# Altium project 1166V10.PrjPCB (part 2 of 2)

## Sheet 1166V10-5.SchDoc: HV-Input & Measurement-Driver
size A3; Author: M. Kutzsche; Organization: Kübrich Ing.-Gesellschaft; Address1: mbH & Co. KG; Address2: Weißmühle 10; Address3: D-96170 Priesendorf; DocumentNumber: UltraZohm; Revision: 10; SheetNumber: 5; SheetTotal: 5
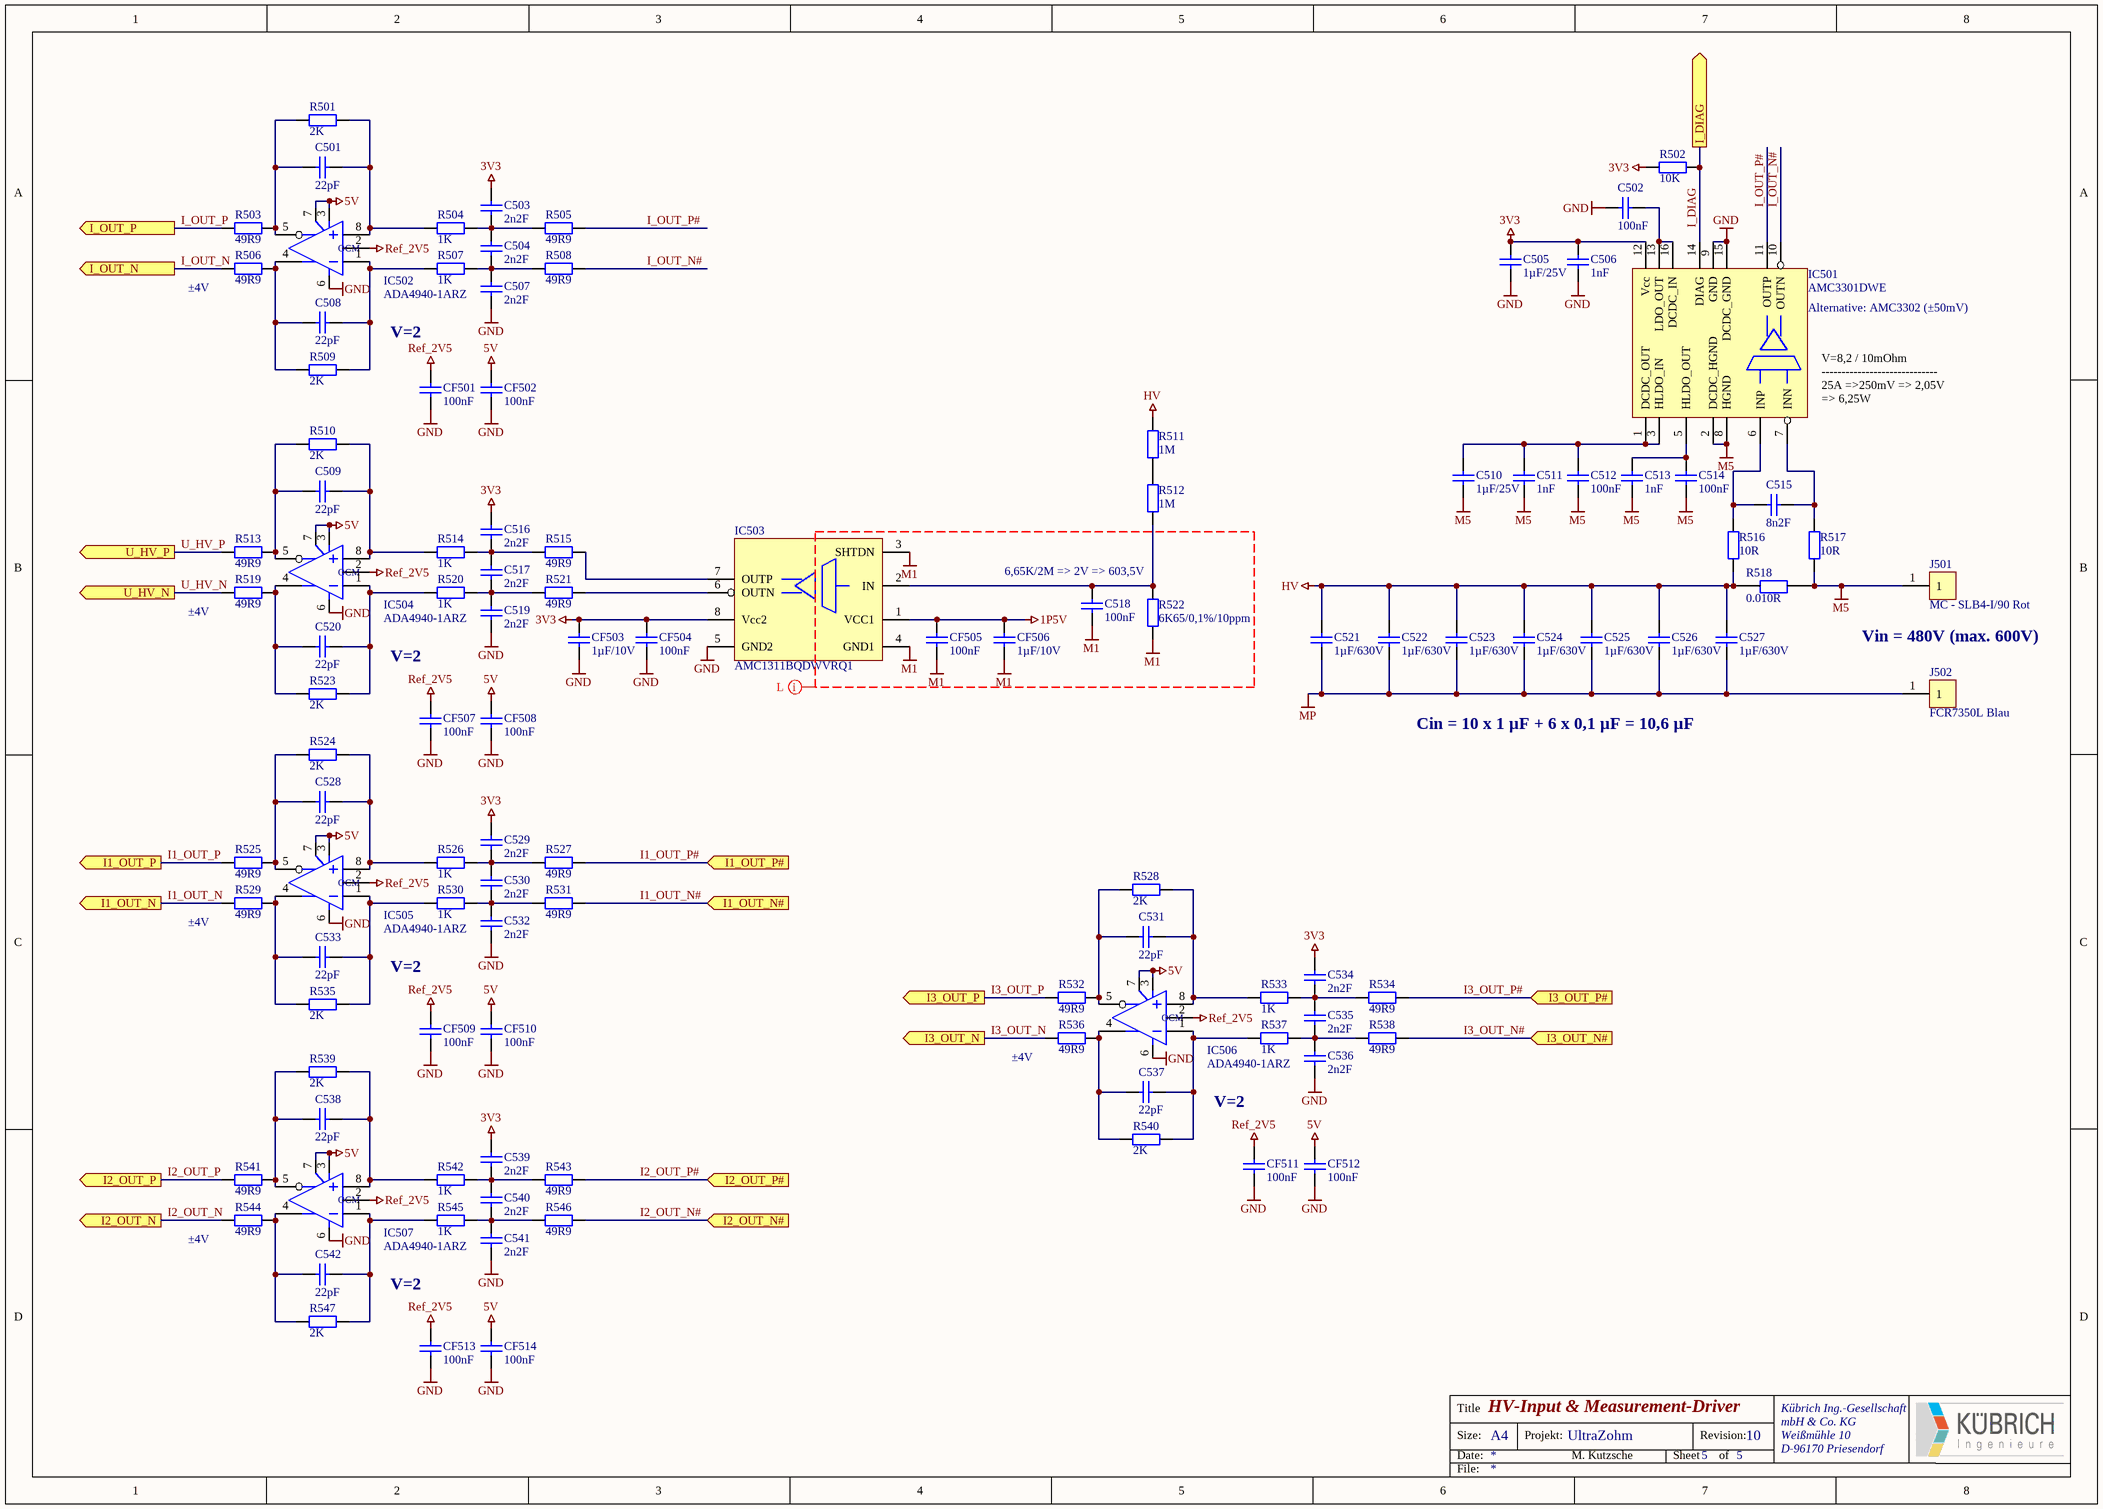
[diagram p4: 1166V10-5.SchDoc]

### Parts
C501  22pF  [0603-Cap]
C502  100nF  [0603-Cap]
C503  2n2F  [0603-Cap]
C504  2n2F  [0603-Cap]
C505  1µF/25V  [1206-Cap]
C506  1nF  [1206-Cap]
C507  2n2F  [0603-Cap]
C508  22pF  [0603-Cap]
C509  22pF  [0603-Cap]
C510  1µF/25V  [0603-Cap]
C511  1nF  [0603-Cap]
C512  100nF  [0603-Cap]
C513  1nF  [1206-Cap]
C514  100nF  [1206-Cap]
C515  8n2F  [0603-Cap]
C516  2n2F  [0603-Cap]
C517  2n2F  [0603-Cap]
C518  100nF  [0603-Cap]
C519  2n2F  [0603-Cap]
C520  22pF  [0603-Cap]
C521  1µF/630V  [2220-Cap]
C522  1µF/630V  [2220-Cap]
C523  1µF/630V  [2220-Cap]
C524  1µF/630V  [2220-Cap]
C525  1µF/630V  [2220-Cap]
C526  1µF/630V  [2220-Cap]
C527  1µF/630V  [2220-Cap]
C528  22pF  [0603-Cap]
C529  2n2F  [0603-Cap]
C530  2n2F  [0603-Cap]
C531  22pF  [0603-Cap]
C532  2n2F  [0603-Cap]
C533  22pF  [0603-Cap]
C534  2n2F  [0603-Cap]
C535  2n2F  [0603-Cap]
C536  2n2F  [0603-Cap]
C537  22pF  [0603-Cap]
C538  22pF  [0603-Cap]
C539  2n2F  [0603-Cap]
C540  2n2F  [0603-Cap]
C541  2n2F  [0603-Cap]
C542  22pF  [0603-Cap]
CF501  100nF  [0603-Cap]
CF502  100nF  [0603-Cap]
CF503  1µF/10V  [0603-Cap]
CF504  100nF  [0603-Cap]
CF505  100nF  [0603-Cap]
CF506  1µF/10V  [0603-Cap]
CF507  100nF  [0603-Cap]
CF508  100nF  [0603-Cap]
CF509  100nF  [0603-Cap]
CF510  100nF  [0603-Cap]
CF511  100nF  [0603-Cap]
CF512  100nF  [0603-Cap]
CF513  100nF  [0603-Cap]
CF514  100nF  [0603-Cap]
IC501  AMC3301DWE  [SOIC-16-W - 8.1mm]
IC502  ADA4940-1ARZ  [SOIC-8-N]
IC503  AMC1311BQDWVRQ1  [SOIC-8-W]
IC504  ADA4940-1ARZ  [SOIC-8-N]
IC505  ADA4940-1ARZ  [SOIC-8-N]
IC506  ADA4940-1ARZ  [SOIC-8-N]
IC507  ADA4940-1ARZ  [SOIC-8-N]
J501  MC - SLB4-I/90 Rot  [SLB4-I/90 - 4mm]
J502  FCR7350L Blau  [SLB4-I/90 - 4mm - CLIFF]
R501  2K  [0603-Res]
R502  10K  [0603-Res]
R503  49R9  [0603-Res]
R504  1K  [0603-Res]
R505  49R9  [0603-Res]
R506  49R9  [0603-Res]
R507  1K  [0603-Res]
R508  49R9  [0603-Res]
R509  2K  [0603-Res]
R510  2K  [0603-Res]
R511  1M  [2512-Res]
R512  1M  [2512-Res]
R513  49R9  [0603-Res]
R514  1K  [0603-Res]
R515  49R9  [0603-Res]
R516  10R  [0603-Res]
R517  10R  [0603-Res]
R518  0.010R  [2512]
R519  49R9  [0603-Res]
R520  1K  [0603-Res]
R521  49R9  [0603-Res]
R522  6K65/0,1%/10ppm  [0603-Res]
R523  2K  [0603-Res]
R524  2K  [0603-Res]
R525  49R9  [0603-Res]
R526  1K  [0603-Res]
R527  49R9  [0603-Res]
R528  2K  [0603-Res]
R529  49R9  [0603-Res]
R530  1K  [0603-Res]
R531  49R9  [0603-Res]
R532  49R9  [0603-Res]
R533  1K  [0603-Res]
R534  49R9  [0603-Res]
R535  2K  [0603-Res]
R536  49R9  [0603-Res]
R537  1K  [0603-Res]
R538  49R9  [0603-Res]
R539  2K  [0603-Res]
R540  2K  [0603-Res]
R541  49R9  [0603-Res]
R542  1K  [0603-Res]
R543  49R9  [0603-Res]
R544  49R9  [0603-Res]
R545  1K  [0603-Res]
R546  49R9  [0603-Res]
R547  2K  [0603-Res]

### Ports
I1_OUT_N (out), I1_OUT_N# (in), I1_OUT_P (out), I1_OUT_P# (in), I2_OUT_N (out), I2_OUT_N# (in), I2_OUT_P (out), I2_OUT_P# (in), I3_OUT_N (out), I3_OUT_N# (in), I3_OUT_P (out), I3_OUT_P# (in), I_DIAG (out), I_OUT_N (out), I_OUT_P (out), U_HV_N (out), U_HV_P (out)

### Nets
1P5V: CF505.1 CF506.1 IC503.1(VCC1)
3V3: C503.2 C505.1 C506.1 C516.2 C529.2 C534.2 C539.2 CF503.1 CF504.1 IC501.12(Vcc) IC503.8(Vcc2) R502.2
5V: CF502.1 CF508.1 CF510.1 CF512.1 CF514.1 IC502.3(V+) IC502.7(EN) IC504.3(V+) IC504.7(EN) IC505.3(V+) IC505.7(EN) IC506.3(V+) IC506.7(EN) IC507.3(V+) IC507.7(EN)
GND: C502.1 C505.2 C506.2 C507.1 C519.1 C532.1 C536.1 C541.1 CF501.2 CF502.2 CF503.2 CF504.2 CF507.2 CF508.2 CF509.2 CF510.2 CF511.2 CF512.2 CF513.2 CF514.2 IC501.9(GND) IC501.15(DCDC_GND) IC502.6(V-) IC503.5(GND2) IC504.6(V-) IC505.6(V-) IC506.6(V-) IC507.6(V-)
HV: C521.1 C522.1 C523.1 C524.1 C525.1 C526.1 C527.1 R511.2 R516.1 R518.1
M1: C518.1 CF505.2 CF506.2 IC503.3(SHTDN) IC503.4(GND1) R522.2
M5: C510.2 C511.2 C512.2 C513.2 C514.2 IC501.2(DCDC_HGND) IC501.8(HGND) J501.1 R517.1 R518.2
MP: C521.2 C522.2 C523.2 C524.2 C525.2 C526.2 C527.2 J502.1
Ref_2V5: CF501.1 CF507.1 CF509.1 CF511.1 CF513.1 IC502.2(OCM) IC504.2(OCM) IC505.2(OCM) IC506.2(OCM) IC507.2(OCM)
I1_OUT_N: R529.2 ; port I1_OUT_N
I1_OUT_N#: R531.1 ; port I1_OUT_N#
I1_OUT_P: R525.2 ; port I1_OUT_P
I1_OUT_P#: R527.1 ; port I1_OUT_P#
I2_OUT_N: R544.2 ; port I2_OUT_N
I2_OUT_N#: R546.1 ; port I2_OUT_N#
I2_OUT_P: R541.2 ; port I2_OUT_P
I2_OUT_P#: R543.1 ; port I2_OUT_P#
I3_OUT_N: R536.2 ; port I3_OUT_N
I3_OUT_N#: R538.1 ; port I3_OUT_N#
I3_OUT_P: R532.2 ; port I3_OUT_P
I3_OUT_P#: R534.1 ; port I3_OUT_P#
I_DIAG: IC501.14(DIAG) R502.1 ; port I_DIAG
I_OUT_N: R506.2 ; port I_OUT_N
I_OUT_N#: IC501.10(OUTN) R508.1
I_OUT_P: R503.2 ; port I_OUT_P
I_OUT_P#: IC501.11(OUTP) R505.1
U_HV_N: R519.2 ; port U_HV_N
U_HV_P: R513.2 ; port U_HV_P
NetC501_1: C501.1 IC502.8(+) R501.1 R504.2
NetC501_2: C501.2 IC502.5(Out) R501.2 R503.1
NetC502_2: C502.2 IC501.13(LDO_OUT) IC501.16(DCDC_IN)
NetC503_1: C503.1 C504.2 R504.1 R505.2
NetC504_1: C504.1 C507.2 R507.1 R508.2
NetC508_1: C508.1 IC502.1(-) R507.2 R509.1
NetC508_2: C508.2 IC502.4(Out) R506.1 R509.2
NetC509_1: C509.1 IC504.8(+) R510.1 R514.2
NetC509_2: C509.2 IC504.5(Out) R510.2 R513.1
NetC510_1: C510.1 C511.1 C512.1 IC501.1(DCDC_OUT) IC501.3(HLDO_IN)
NetC513_1: C513.1 C514.1 IC501.5(HLDO_OUT)
NetC515_1: C515.1 IC501.7(INN) R517.2
NetC515_2: C515.2 IC501.6(INP) R516.2
NetC516_1: C516.1 C517.2 R514.1 R515.2
NetC517_1: C517.1 C519.2 R520.1 R521.2
NetC518_2: C518.2 IC503.2(IN) R512.1 R522.1
NetC520_1: C520.1 IC504.1(-) R520.2 R523.1
NetC520_2: C520.2 IC504.4(Out) R519.1 R523.2
NetC528_1: C528.1 IC505.8(+) R524.1 R526.2
NetC528_2: C528.2 IC505.5(Out) R524.2 R525.1
NetC529_1: C529.1 C530.2 R526.1 R527.2
NetC530_1: C530.1 C532.2 R530.1 R531.2
NetC531_1: C531.1 IC506.8(+) R528.1 R533.2
NetC531_2: C531.2 IC506.5(Out) R528.2 R532.1
NetC533_1: C533.1 IC505.1(-) R530.2 R535.1
NetC533_2: C533.2 IC505.4(Out) R529.1 R535.2
NetC534_1: C534.1 C535.2 R533.1 R534.2
NetC535_1: C535.1 C536.2 R537.1 R538.2
NetC537_1: C537.1 IC506.1(-) R537.2 R540.1
NetC537_2: C537.2 IC506.4(Out) R536.1 R540.2
NetC538_1: C538.1 IC507.8(+) R539.1 R542.2
NetC538_2: C538.2 IC507.5(Out) R539.2 R541.1
NetC539_1: C539.1 C540.2 R542.1 R543.2
NetC540_1: C540.1 C541.2 R545.1 R546.2
NetC542_1: C542.1 IC507.1(-) R545.2 R547.1
NetC542_2: C542.2 IC507.4(Out) R544.1 R547.2
NetIC503_6: IC503.6(OUTN) R521.1
NetIC503_7: IC503.7(OUTP) R515.1
NetR511_1: R511.1 R512.2

### Layout directives
net class L: 1P5V, M1

### Notes on the sheet
- (near R506) ±4V
- (near IC501) Alternative: AMC3302 (±50mV)
- V=2
- (near IC501) V=8,2 / 10mOhm
  -----------------------------
  25A =>250mV => 2,05V
  => 6,25W
- 6,65K/2M => 2V => 603,5V
- (near R519) ±4V
- Vin = 480V (max. 600V)
- Cin = 10 x 1 µF + 6 x 0,1 µF = 10,6 µF
- (near R529) ±4V
- (near R536) ±4V
- (near R544) ±4V
- Title
- Size:
- Date:
- A4
- Projekt:
- Sheet
- Revision:
- of
- File:

### Library data of the parts
C501-C542 CF501-CF514 = Cap_SMD: Capacitor (SMD); Class I: Pasiv; Class II: Capacitor; Last edited: 20.11.2006 10:25
  C501 C508 C509 C520 C528 C531 C533 C537 C538 C542: value: 22pF
  C502 C512 C514 C518 CF501 CF502 CF504 CF505 CF507-CF514: value: 100nF
  C503 C504 C507 C516 C517 C519 C529 C530 C532 C534-C536 C539-C541: value: 2n2F
  C505 C510: value: 1µF/25V
  C506 C511 C513: value: 1nF
  C515: value: 8n2F
  C521-C527: value: 1µF/630V
  CF503 CF506: value: 1µF/10V
IC501 = AMC3301DWE: ±250 mV Input Voltage Range, Reinforced Isolated Amplifier and High Bandwidth of 300 kHz; Manufacturer: Texas Instruments; Class II: ±250 mV, 300KHz, -40-125°C; Package information: Unknown; Best.-Nr.: DigiKey: 296-AMC3301DWE-ND; Class I: Isolated Amplifier; Datasheet: Unknown; Package reference: SOIC-16-W
IC502 IC504-IC507 = ADA4940-1ARZ: Fully Differential ADC Drivers (-40-125°C); Manufacturer: ANALOG DEVICES; Class I: Analog; Best.-Nr.: Farnell 209-6178; Class II: Fully Differential ADC Drivers (-40-125°C); Datasheet: DSO11449, Ver. Aug 2000; Last edited: 04.01.2007 10:14; Package Reference: SOIC-N-8
IC503 = AMC1311BQDWVRQ1: 2V Input, Automotive High-Impedance, Reinforced Isolated Amplifier for Voltage Sensing; Manufacturer: Texas Instruments; Class II: 2V, 275KHz, -40-125°C; Package information: Unknown; Best.-Nr.: Mouser: 595-AMC1311BQDWVRQ1; Class I: Isolated Amplifier; Datasheet: Unknown; Package reference: SOIC-8-W
J501 = MC - SLB4-I/90 Rot: Labor Winkelbuchsen 4mm Rot; Manufacturer: Multi-Contact; Class I: Connectors; Best.-Nr.: Farnell: 413-0261; Class II: Labor Winkelbuchsen 4mm Rot; Last edited: 07.03.2007 13:28
J502 = FCR7350L Blau: Labor Winkelbuchsen 4mm Blau; Manufacturer: CLIFF Electronic; Class I: Connectors; Best.-Nr.: Farnell: 185-4511; Class II: Labor Winkelbuchsen 4mm Blau; Last edited: 07.03.2007 13:28
R501-R510 R513-R517 R519-R547 = Res_SMD: Resistor SMD; Class I: Pasiv; Class II: Resistor; Last edited: 17.11.2006 11:38
  R501 R509 R510 R523 R524 R528 R535 R539 R540 R547: value: 2K
  R502: value: 10K
  R503 R505 R506 R508 R513 R515 R519 R521 R525 R527 R529 R531 R532 R534 R536 R538 R541 R543 R544 R546: value: 49R9
  R504 R507 R514 R520 R526 R530 R533 R537 R542 R545: value: 1K
  R516 R517: value: 10R
  R522: value: 6K65/0,1%/10ppm
R511 R512 = HVCB2512BDE1M00: Resistor SMD 1M/0,1%/3KV/2W/25ppm/°C; Class I: Pasiv; Best.-Nr.: DigiKey: HVCB2512BDE1M00CT-ND; Class II: Resistor; Last edited: 17.11.2006 11:38; value: 1M
R518 = LRMAP2512-R01FT4: 10mOhm, 3W, 1%, 50ppm/°C; Manufacturer: TT Electronics; Class I: Pasiv; Class II: Shunt 3W; Best.-Nr.: Farnell: 207-9429; Last edited: 23.11.2010 14:12; value: 0.010R

## Nets that join several sheets
1P5V: 1166V10-2 (10 pins), 1166V10-3 (6 pins), 1166V10-4 (6 pins), 1166V10-5 (CF505.1 CF506.1 IC503.1)
1P12V: 1166V10-2 (8 pins), 1166V10-3 (C322.2 Q302.46), 1166V10-4 (C422.2 Q402.46)
3V3: 1166V10-1 (29 pins), 1166V10-2 (18 pins), 1166V10-3 (18 pins), 1166V10-4 (18 pins), 1166V10-5 (12 pins)
5V: 1166V10-1 (C106.2 C107.2 L102.2), 1166V10-2 (CF211.1 IC206.3 IC206.7), 1166V10-3 (CF308.1 IC305.3 IC305.7), 1166V10-4 (CF408.1 IC405.3 IC405.7), 1166V10-5 (15 pins)
GND: 1166V10-1 (89 pins), 1166V10-2 (26 pins), 1166V10-3 (23 pins), 1166V10-4 (23 pins), 1166V10-5 (28 pins)
HV: 1166V10-2 (21 pins), 1166V10-3 (21 pins), 1166V10-4 (21 pins), 1166V10-5 (10 pins)
M1: 1166V10-2 (27 pins), 1166V10-3 (18 pins), 1166V10-4 (18 pins), 1166V10-5 (6 pins)
MP: 1166V10-1 (JX101.1 JX102.1 JX103.1 JX104.1), 1166V10-2 (31 pins), 1166V10-3 (31 pins), 1166V10-4 (31 pins), 1166V10-5 (8 pins)
P24V: 1166V10-1 (D101.2 J101.2 J102.5 J102.6), 1166V10-2 (C206.2 C222.2 L201.1 L204.1), 1166V10-3 (C306.2 L301.1), 1166V10-4 (C406.2 L401.1)
Ref_2V5: 1166V10-1 (5 pins), 1166V10-2 (CF210.1 IC206.2), 1166V10-3 (CF307.1 IC305.2), 1166V10-4 (CF407.1 IC405.2), 1166V10-5 (10 pins)
GaN_H1_FAULT: 1166V10-1 (IC101.12 J102.50), 1166V10-2 (IC202.12 R201.2)
GaN_H1_OC: 1166V10-1 (IC101.10 J102.46), 1166V10-2 (IC202.13 R202.2)
GaN_H1_Temp: 1166V10-1 (J102.30), 1166V10-2 (IC202.14)
GaN_H2_FAULT: 1166V10-1 (IC105.12 J102.74), 1166V10-3 (IC302.12 R301.2)
GaN_H2_OC: 1166V10-1 (IC105.10 J102.70), 1166V10-3 (IC302.13 R302.2)
GaN_H2_Temp: 1166V10-1 (J102.54), 1166V10-3 (IC302.14)
GaN_H3_FAULT: 1166V10-1 (IC109.12 J102.73), 1166V10-4 (IC402.12 R401.2)
GaN_H3_OC: 1166V10-1 (IC109.10 J102.69), 1166V10-4 (IC402.13 R402.2)
GaN_H3_Temp: 1166V10-1 (J102.53), 1166V10-4 (IC402.14)
GaN_L1_FAULT: 1166V10-1 (IC101.4 J102.42), 1166V10-2 (IC204.14 R204.2)
GaN_L1_OC: 1166V10-1 (IC101.2 J102.38), 1166V10-2 (IC204.13 R207.2)
GaN_L1_Temp: 1166V10-1 (J102.34), 1166V10-2 (IC204.12)
GaN_L2_FAULT: 1166V10-1 (IC105.4 J102.66), 1166V10-3 (IC303.14 R304.2)
GaN_L2_OC: 1166V10-1 (IC105.2 J102.62), 1166V10-3 (IC303.13 R307.2)
GaN_L2_Temp: 1166V10-1 (J102.58), 1166V10-3 (IC303.12)
GaN_L3_FAULT: 1166V10-1 (IC109.4 J102.65), 1166V10-4 (IC403.14 R404.2)
GaN_L3_OC: 1166V10-1 (IC109.2 J102.61), 1166V10-4 (IC403.13 R407.2)
GaN_L3_Temp: 1166V10-1 (J102.57), 1166V10-4 (IC403.12)
I1_DIAG: 1166V10-1 (J102.29), 1166V10-2 (IC201.14 R203.1)
I1_OUT_N: 1166V10-1 (J103.2), 1166V10-5 (R529.2)
I1_OUT_N#: 1166V10-2 (IC201.10), 1166V10-5 (R531.1)
I1_OUT_P: 1166V10-1 (J103.1), 1166V10-5 (R525.2)
I1_OUT_P#: 1166V10-2 (IC201.11), 1166V10-5 (R527.1)
I2_DIAG: 1166V10-1 (J102.33), 1166V10-3 (IC301.14 R303.1)
I2_OUT_N: 1166V10-1 (J103.6), 1166V10-5 (R544.2)
I2_OUT_N#: 1166V10-3 (IC301.10), 1166V10-5 (R546.1)
I2_OUT_P: 1166V10-1 (J103.3), 1166V10-5 (R541.2)
I2_OUT_P#: 1166V10-3 (IC301.11), 1166V10-5 (R543.1)
I3_DIAG: 1166V10-1 (J102.37), 1166V10-4 (IC401.14 R403.1)
I3_OUT_N: 1166V10-1 (J103.5), 1166V10-5 (R536.2)
I3_OUT_N#: 1166V10-4 (IC401.10), 1166V10-5 (R538.1)
I3_OUT_P: 1166V10-1 (J103.4), 1166V10-5 (R532.2)
I3_OUT_P#: 1166V10-4 (IC401.11), 1166V10-5 (R534.1)
I_DIAG: 1166V10-1 (J102.41), 1166V10-5 (IC501.14 R502.1)
I_OUT_N: 1166V10-1 (J104.8), 1166V10-5 (R506.2)
I_OUT_P: 1166V10-1 (J104.7), 1166V10-5 (R503.2)
PWM_H1: 1166V10-1 (IC101.6 IC104.3 TP101.1), 1166V10-2 (R208.2)
PWM_H2: 1166V10-1 (IC105.6 IC108.3 TP103.1), 1166V10-3 (R308.2)
PWM_H3: 1166V10-1 (IC109.6 IC113.3 TP105.1), 1166V10-4 (R408.2)
PWM_L1: 1166V10-1 (IC101.8 IC104.1 TP102.1), 1166V10-2 (R214.2)
PWM_L2: 1166V10-1 (IC105.8 IC108.1 TP104.1), 1166V10-3 (R314.2)
PWM_L3: 1166V10-1 (IC109.8 IC113.1 TP106.1), 1166V10-4 (R414.2)
U_HV_N: 1166V10-1 (J103.8), 1166V10-5 (R519.2)
U_HV_P: 1166V10-1 (J103.7), 1166V10-5 (R513.2)
U_L1_N: 1166V10-1 (J104.2), 1166V10-2 (R221.2)
U_L1_P: 1166V10-1 (J104.1), 1166V10-2 (R216.2)
U_L2_N: 1166V10-1 (J104.6), 1166V10-3 (R321.2)
U_L2_P: 1166V10-1 (J104.3), 1166V10-3 (R316.2)
U_L3_N: 1166V10-1 (J104.5), 1166V10-4 (R421.2)
U_L3_P: 1166V10-1 (J104.4), 1166V10-4 (R416.2)

## Assembly variants
Variant V10: not fitted C216 C230 C316 C326 C416 C426 J101 J104 JX101 JX102 JX103 JX104 KIng101 P101 PM101 PM102 PM103 PM104 PM105 PM106 R102 R?